# Altium schematic sheet LEDs.SchDoc
size A4; CompanyName: Technische Hochschule Nürnberg Georg Simon Ohm; Address1: Fürther Straße 250; Address2: 90429 Nürnberg; Address3: GERMANY; SheetNumber: 20; SheetTotal: 21; CompanyName2: Institut ELSYS
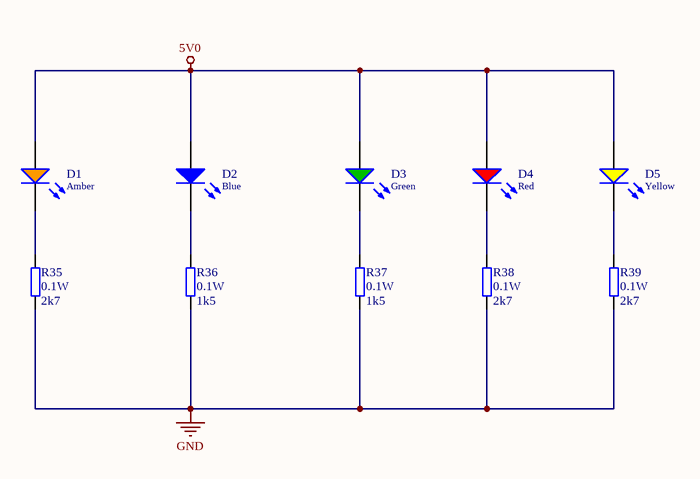
[diagram p0: LEDs.SchDoc]

## Parts
D1  Amber  [WL-SMCW_0603]
D2  Blue  [WL-SMCW_0603]
D3  Green  [WL-SMCW_0603]
D4  Red  [WL-SMCW_0603]
D5  Yellow  [WL-SMCW_0603]
R35  0.1W  value 2k7  [RESC1608X55X30NL15T15]
R36  0.1W  value 1k5  [RESC1608X55X30NL15T15]
R37  0.1W  value 1k5  [RESC1608X55X30NL15T15]
R38  0.1W  value 2k7  [RESC1608X55X30NL15T15]
R39  0.1W  value 2k7  [RESC1608X55X30NL15T15]

## Nets
5V0: D1.2(A) D2.2(A) D3.2(A) D4.2(A) D5.2(A)
GND: R35.2 R36.2 R37.2 R38.2 R39.2
NetD1_1: D1.1(K) R35.1
NetD2_1: D2.1(K) R36.1
NetD3_1: D3.1(K) R37.1
NetD4_1: D4.1(K) R38.1
NetD5_1: D5.1(K) R39.1

## Notes on the sheet
- Title
- Size:
- Date:
- A4
- Revision:
- Time:
- Sheet
- of
- Author:
- Project:

## Library data of the parts
D1 = LED_Amber: WL-SMCW SMD Mono-color Chip LED Waterclear, size 0603, Red, 2 V, 140°; MPN1: 150060AS75000; Forward Voltage: 2 V; Luminous Intensity: 250 mcd; Peak Wavelength: 610nm; Dominant Wavelength: 605nm; MF1: Wuerth Elektronik; Value: 150060AS75000; Published Date: Sep. 2017; ComponentLink1Description: Manufacturer; ComponentLink1URL: http://www.we-online.de; ComponentLink2Description: Datasheet; ComponentLink2URL: http://katalog.we-online.com/led/datasheet/150060AS75000.pdf; Size: 0603; Viewing Angle: 140°; Package: 0603; Created: 2020-01-07_Thilo_Wendt; Supplier 1: Digi-Key; Supplier Part Number 1: 732-150060AS75000CT-ND; Emitting Color: Amber
D2 = LED_Blue: WL-SMCW SMD Mono-color Chip LED Waterclear, size 0603, Blue, 3.2 V, 140°; MPN: 150060BS75000; Forward Voltage: 3.2 V; Luminous Intensity: 145 mcd; Peak Wavelength: 465 nm; Dominant Wavelength: 470 nm; MF: Wuerth Elektronik; Value: 150060BS75000; Published Date: Sep. 2017; ComponentLink1Description: Manufacturer; ComponentLink1URL: http://www.we-online.de; ComponentLink2Description: Datasheet; ComponentLink2URL: http://katalog.we-online.com/led/datasheet/150060BS75000.pdf; Size: 0603; Viewing Angle: 140°; Package: 0603; Created: 2018_09_06_AGeiger; Supplier 1: Farnell; Supplier Part Number 1: 2322069; Supplier 2: Mouser; Supplier Part Number 2: 710-150060BS75000; Supplier 3: Digi-Key; Supplier Part Number 3: 732-4966-1-ND; Emitting Color: Blue
D3 = LED_Green: WL-SMCW SMD Mono-color Chip LED Waterclear, size 0603, Green, 3.2 V, 140°; MPN: 150060GS75000; Forward Voltage: 3.2 V; Luminous Intensity: 430 mcd; Peak Wavelength: 515 nm; Dominant Wavelength: 520 nm; MF: Wuerth Elektronik; Value: 150060GS75000; Published Date: Sep. 2017; ComponentLink1Description: Manufacturer; ComponentLink1URL: http://www.we-online.de; ComponentLink2Description: Datasheet; ComponentLink2URL: http://katalog.we-online.com/led/datasheet/150060GS75000.pdf; Size: 0603; Viewing Angle: 140°; Package: 0603; Created: 2018_09_06_AGeiger; Supplier 1: Farnell; Supplier Part Number 1: 2322070; Supplier 2: Mouser; Supplier Part Number 2: 710-150060GS75000; Supplier 3: Digi-Key; Supplier Part Number 3: 732-4971-1-ND; Emitting Color: Green
D4 = LED_Red: WL-SMCW SMD Mono-color Chip LED Waterclear, size 0603, Red, 2 V, 140°; MPN: 150060RS75000; Forward Voltage: 2 V; Luminous Intensity: 250 mcd; Peak Wavelength: 630 nm; Dominant Wavelength: 625 nm; MF: Wuerth Elektronik; Value: 150060RS75000; Published Date: Sep. 2017; ComponentLink1Description: Manufacturer; ComponentLink1URL: http://www.we-online.de; ComponentLink2Description: Datasheet; ComponentLink2URL: http://katalog.we-online.com/led/datasheet/150060RS75000.pdf; Size: 0603; Viewing Angle: 140°; Package: 0603; Created: 2018_09_06_AGeiger; Supplier 1: Farnell; Supplier Part Number 1: 2322071; Supplier 2: Mouser; Supplier Part Number 2: 710-150060RS75000; Supplier 3: Digi-Key; Supplier Part Number 3: 732-4978-1-ND; Emitting Color: Red
D5 = LED_Yellow: WL-SMCW SMD Mono-color Chip LED Waterclear, size 0603, Red, 2 V, 140°; MPN1: 150060YS75000; Forward Voltage: 2 V; Luminous Intensity: 250 mcd; Peak Wavelength: 595; Dominant Wavelength: 590; MF1: Wuerth Elektronik; Value: 150060YS75000; Published Date: Sep. 2017; ComponentLink1Description: Manufacturer; ComponentLink1URL: http://www.we-online.de; ComponentLink2Description: Datasheet; ComponentLink2URL: http://katalog.we-online.com/led/datasheet/150060YS75000.pdf; Size: 0603; Viewing Angle: 140°; Package: 0603; Created: 2020-01-07_Thilo_Wendt; Supplier 1: Digi-Key; Supplier 2: Digi-Key; Supplier 3: Digi-Key; Supplier Part Number 1: 732-5000-1-ND; Supplier Part Number 2: 732-4987-1-ND; Supplier Part Number 3: 732-4981-1-ND; Emitting Color: Yellow
R35-R39 = R_0.1W_SMD: Standard thick film resistor; Manufacturer1: Panasonic; MPN1: ERJU<pkg><tol><val><pkg_meth>; Parameter1: V; Parameter1Desc: Package Method; Parameter2: F; Parameter2Desc: Tolerance Symbol; MaxVoltage: 100; Created: 2019-12-08_Thilo_Wendt; Supplier1: https://de.farnell.com/w/search?qualifizierungsstandard-der-automobilindustrie=aec-q200&range=inc-in-stock&st=erju; Package: RESC1608X55X30NL15T15; HelpURL: https://www.mouser.de/datasheet/2/315/AOA0000C334-1314047.pdf; Parameter3: *; Parameter3Desc: *; ComponentLink1Description: Datasheet; ComponentLink1URL: https://www.mouser.de/datasheet/2/315/AOA0000C334-1314047.pdf